# Altium schematic sheet Power_ORing.SchDoc
size B
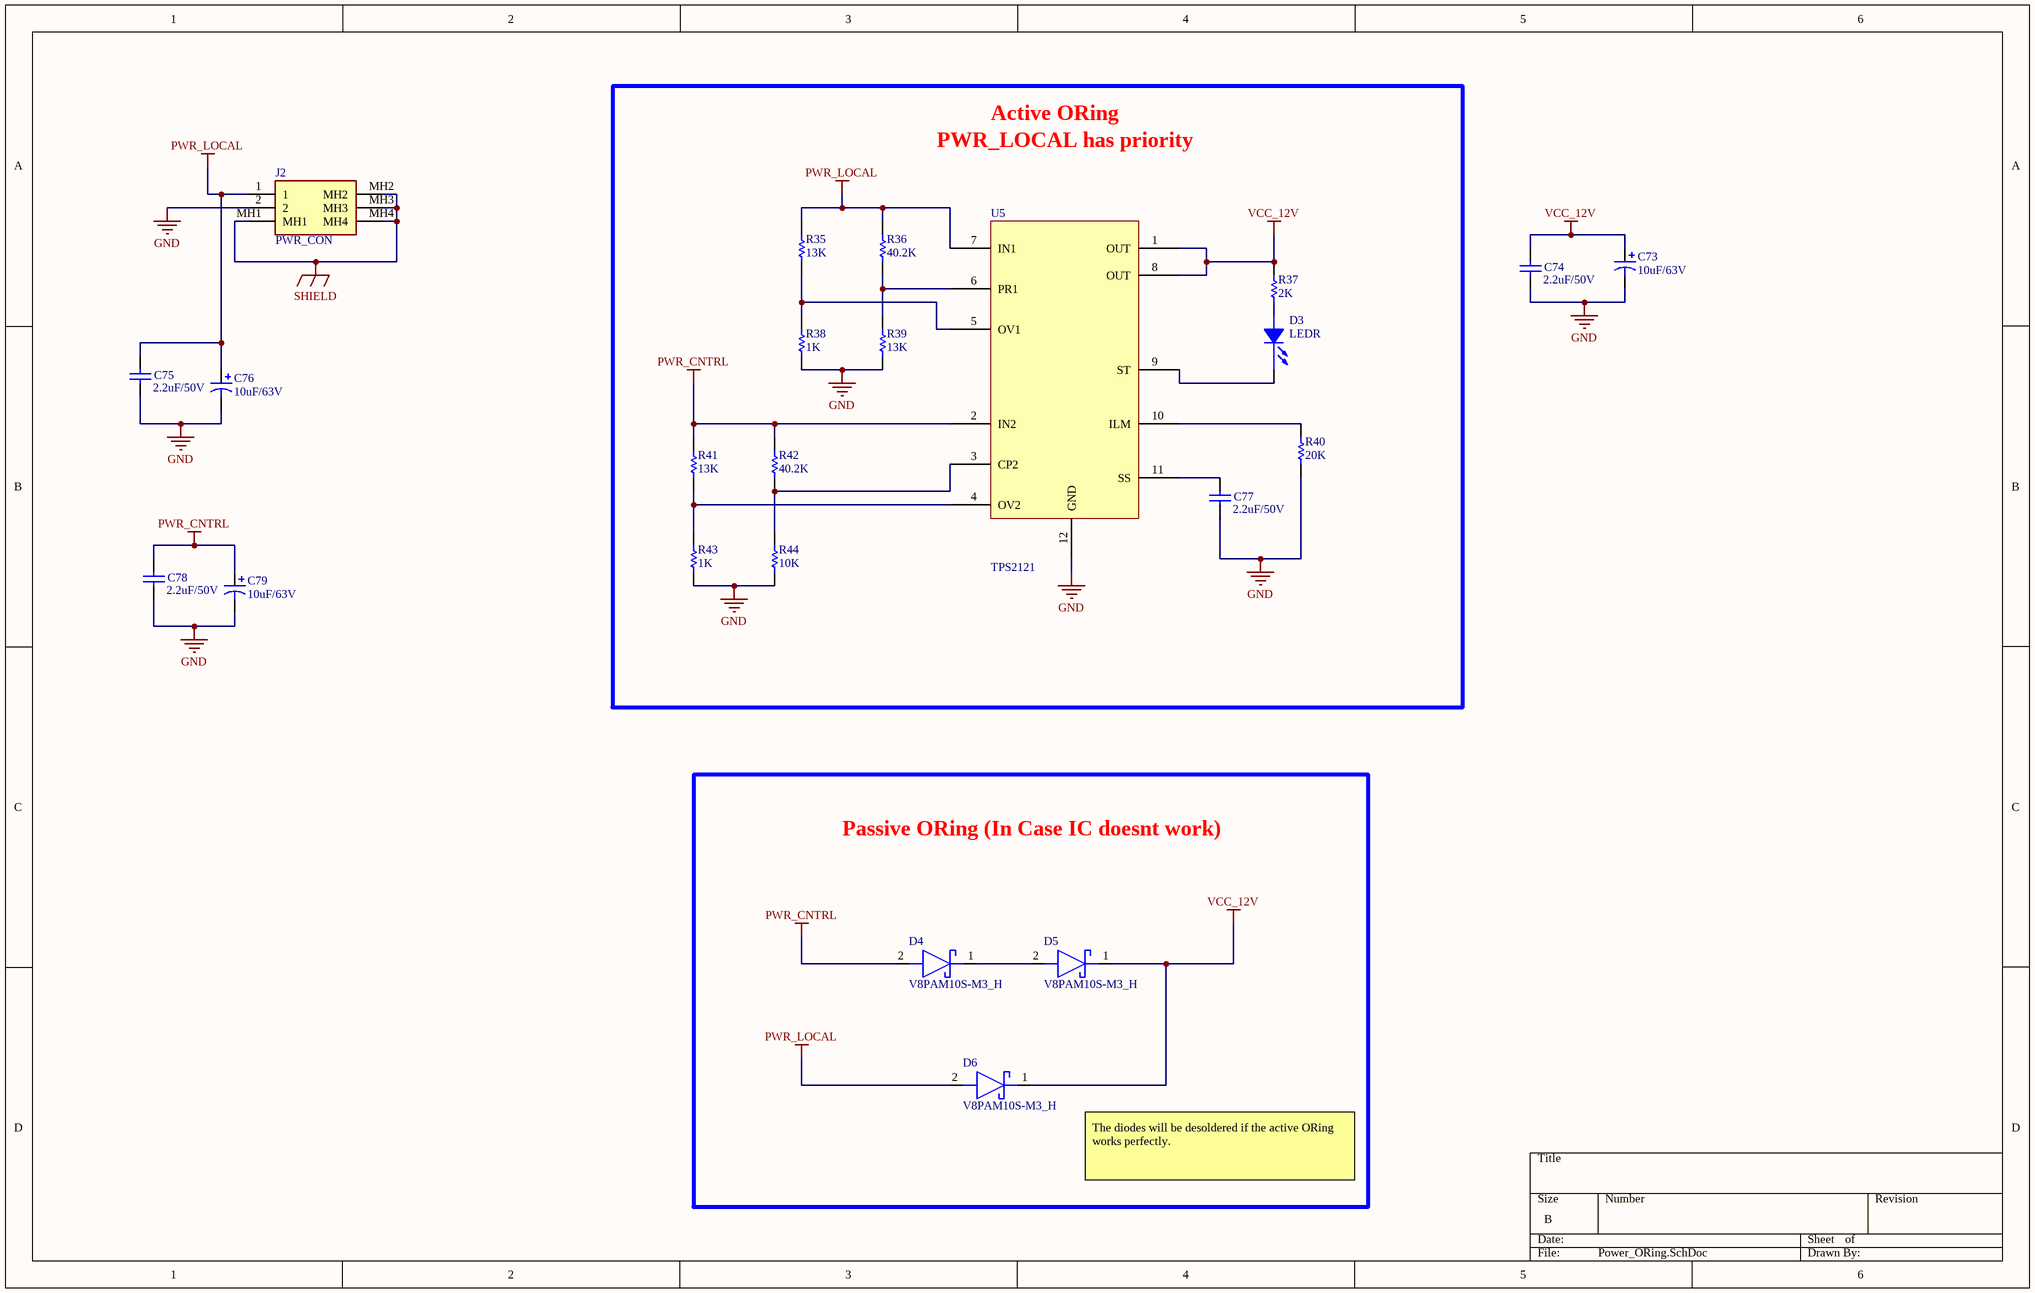
[diagram p0: Power_ORing.SchDoc]

## Parts
C73  10uF/63V  [EEE-FN1J100L]
C74  2.2uF/50V  [0603C]
C75  2.2uF/50V  [0603C]
C76  10uF/63V  [EEE-FN1J100L]
C77  2.2uF/50V  [0603C]
C78  2.2uF/50V  [0603C]
C79  10uF/63V  [EEE-FN1J100L]
D3  LEDR  [LED_0603]
D4  V8PAM10S-M3_H  [V8PAM10SHM3H]
D5  V8PAM10S-M3_H  [V8PAM10SHM3H]
D6  V8PAM10S-M3_H  [V8PAM10SHM3H]
J2  PWR_CON  [PJ082BH]
R35  13K  [0603R]
R36  40.2K  [0603R]
R37  2K  [0603R]
R38  1K  [0603R]
R39  13K  [0603R]
R40  20K  [0603R]
R41  13K  [0603R]
R42  40.2K  [0603R]
R43  1K  [0603R]
R44  10K  [0603R]
U5  TPS2121

## Blocks framed on the sheet
Passive ORing (In Case IC doesnt work): D4-D6

## Nets
GND: C73.2 C74.1 C75.1 C76.2 C77.1 C78.1 C79.2 J2.2 R38.1 R39.2 R40.2 R43.1 R44.2 U5.12(GND)
PWR_CNTRL: C78.2 C79.1 D4.2(A) R41.1 R42.2 U5.2(IN2)
PWR_LOCAL: C75.2 C76.1 D6.2(A) J2.1 R35.1 R36.2 U5.7(IN1)
SHIELD: J2.MH1 J2.MH2 J2.MH3 J2.MH4
VCC_12V: C73.1 C74.2 D5.1(K) D6.1(K) R37.1 U5.1(OUT) U5.8(OUT)
NetC77_2: C77.2 U5.11(SS)
NetD3_1: D3.1(ANODE) R37.2
NetD3_2: D3.2(CATHODE) U5.9(ST)
NetD4_1: D4.1(K) D5.2(A)
NetR35_2: R35.2 R38.2 U5.5(OV1)
NetR36_1: R36.1 R39.1 U5.6(PR1)
NetR40_1: R40.1 U5.10(ILM)
NetR41_2: R41.2 R43.2 U5.4(OV2)
NetR42_1: R42.1 R44.1 U5.3(CP2)

## Notes on the sheet
- PWR_LOCAL has priority
- Active ORing
- The diodes will be desoldered if the active ORing works perfectly.

## Library data of the parts
C73 C76 C79 = Cap Pol1: Polarized Capacitor (Radial); Mfr: Panasonic; Value: 10uF/63V; Mfr Part No: EEE-FN1J100L; Package: SMD; Stockiest: MOUSER; Price: 0.484; Stockiest Part No: 667-EEE-FN1J100L
C74 C75 C77 C78 = Cap: Multilayer Ceramic Capacitors MLCC - SMD/SMT 0603 2.2uF 20% 50VDC X5R; Mfr: Murata Electronics; Mfr Part No: GRM188R61H225ME11J; Package: 0603; Price: 0.333; Stockiest: MOUSER; Stockiest Part No: 81-GRM188R61H225ME1J; Value: 2.2uF/50V
D3 = LED: Standard LEDs - SMD Red 631nm 14mcd 5mA; Mfr: Lite-On; Mfr Part No: LTST-C193KRKT-5A; Package: 0603; Price: 0.393; Stockiest: MOUSER; Stockiest Part No: 859-LTSTC193KRKT5A; Value: RED
D4-D6 = V8PAM10S-M3_H: Schottky Diodes & Rectifiers 8A 100V; Mfr: Vishay General Semiconductor; Mfr Part No: V8PAM10S-M3/H; Price: 0.39; Stockiest: MOUSER; Stockiest Part No: 78-V8PAM10S-M3/H
J2 = PJ-082BH: DC Power Connectors 2.5mm x 5.5mm horz; Mfr: CUI Devices; Mfr Part No: PJ-082BH; Price: 1.70; Stockiest: MOUSER; Stockiest Part No: 490-PJ-082BH
R35 R39 R41 = Res1: Thin Film Resistors - SMD 13K ohm 0.1% 25 ppm; Mfr: KOA Speer; Mfr Part No: RN73R1JTTD1302B25; Package: 0603; Price: 0.503; Stockiest: MOUSER; Stockiest Part No: 660-RN73R1JTD1302B25; Value: 13K
R36 R42 = Res1: Thick Film Resistors - SMD 0603 Anti-Surge Res. 0.1%, 40.2Koh; Mfr: Panasonic; Mfr Part No: ERJ-PB3B4022V; Package: 0603; Price: 0.252; Stockiest: MOUSER; Stockiest Part No: 667-ERJ-PB3B4022V; Value: 40.2K
R37 R44 = Res1: Thick Film Resistors - SMD 0603 10Kohms 1% Anti-Sulfur AEC-Q200; Mfr: ROHM Semiconductor; Mfr Part No: SFR03EZPF1002; Package: 0603; Price: 0.101; Stockiest: MOUSER; Stockiest Part No: 755-SFR03EZPF1002
  R37: Value: 2K
  R44: Value: 10K
R38 R43 = Res1: Resistor; Mfr: Vishay / Dale; Mfr Part No: CRCW06031K00FKEAC; Package: 0603; Price: 0.1; Stockiest: MOUSER; Stockiest Part No: 71-CRCW06031K00FKEAC; Value: 1K
R40 = Res1: Thick Film Resistors - SMD 20K OHM .1% 25PPM; Mfr: KOA Speer; Mfr Part No: RS73F1JTTD2002B; Package: 0603; Price: 0.61; Stockiest: MOUSER; Stockiest Part No: 660-RS73F1JTTD2002B; Value: 20K
U5 = TPS2121: Power Switch ICs - Power Distribution; Mfr: Texas Instruments; Mfr Part No: TPS2121RUXT; Price: 2.40; Stockiest: MOUSER; Stockiest Part No: 595-TPS2121RUXT